# Altium schematic sheet Block_Diagram.SchDoc
size A; SheetNumber: 1; SheetTotal: 6
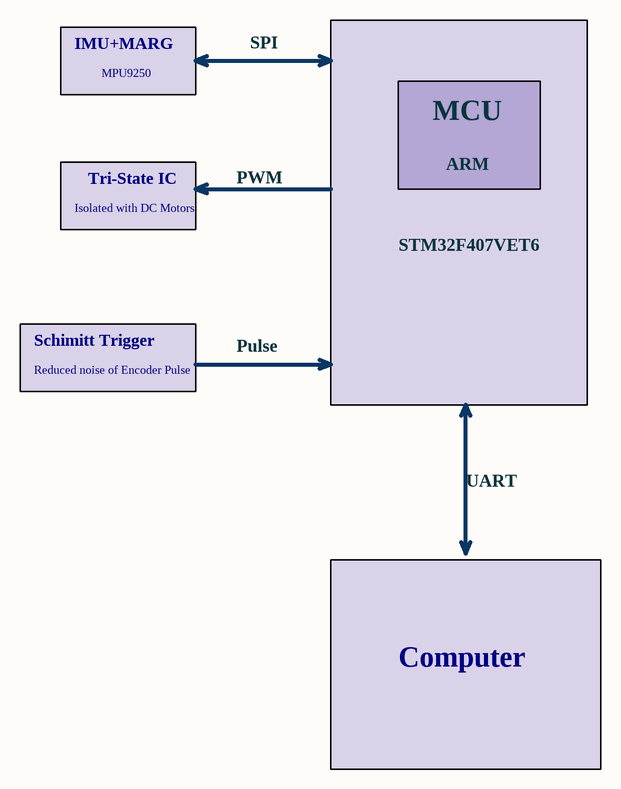
[diagram p0: Block_Diagram.SchDoc]

## Notes on the sheet
- IMU+MARG
- MPU9250
- SPI
- MCU
- ARM
- Isolated with DC Motors
- Tri-State IC
- PWM
- STM32F407VET6
- Schimitt Trigger
- Reduced noise of Encoder Pulse
- Pulse
- UART
- Computer